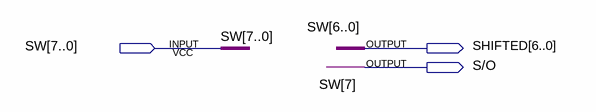
[diagram p0: schematic sheet]
// Quartus schematic SHIFT.bdf as structural Verilog: 0 symbols, 3 pins
module SHIFT (
  input  [7:0] SW,
  output [6:0] SHIFTED,
  output \S/O 
);


  assign \S/O  = SW[7];
  assign SHIFTED = SW[6:0];
endmodule
